# Altium schematic sheet tiny_control.SchDoc
size A4
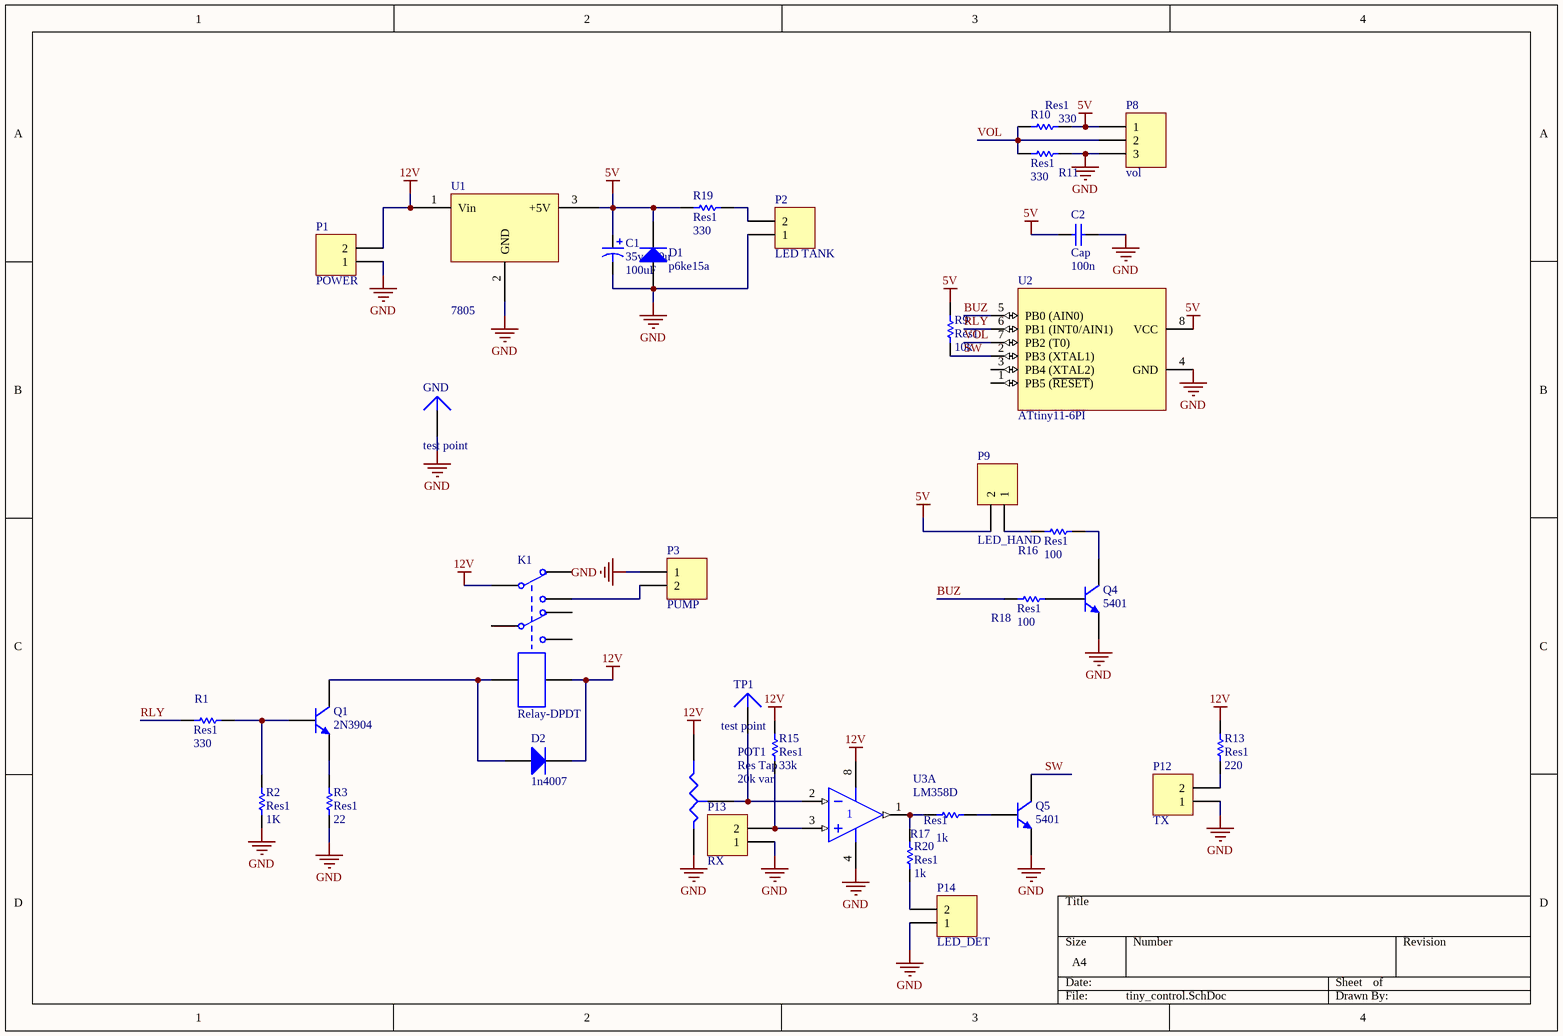
[diagram p0: tiny_control.SchDoc]

## Parts
C1  35v 100u  value 100uF  [cap5]
C2  Cap  value 100n  [RAD-0.1]
D1  p6ke15a  [DIODE-0.4]
D2  1n4007  [DIO7.1-3.9x1.9]
GND  test point  [PIN1]
K1  Relay-DPDT  [My_REL_cochick]
P1  POWER  [con2_2.54]
P2  LED TANK  [con2_2.54]
P3  PUMP  [con2_2.54]
P8  vol  [con3_2.54]
P9  LED_HAND  [con2_2.54]
P12  TX  [con2_2.54]
P13  RX  [con2_2.54]
P14  LED_DET  [con2_2.54]
POT1  Res Tap  value 20k var  [VR5]
Q1  2N3904  [TO-92C]
Q4  5401  [TO-92C]
Q5  5401  [TO-92C]
R1  Res1  value 330  [AXIAL-0.3]
R2  Res1  value 1K  [AXIAL-0.3]
R3  Res1  value 22  [AXIAL-0.3]
R9  Res1  value 10k  [AXIAL-0.3]
R10  Res1  value 330  [AXIAL-0.3]
R11  Res1  value 330  [AXIAL-0.3]
R13  Res1  value 220  [AXIAL-0.3]
R15  Res1  value 33k  [AXIAL-0.3]
R16  Res1  value 100  [AXIAL-0.3]
R17  Res1  value 1k  [AXIAL-0.3]
R18  Res1  value 100  [AXIAL-0.3]
R19  Res1  value 330  [AXIAL-0.3]
R20  Res1  value 1k  [AXIAL-0.3]
TP1  test point  [PIN1]
U1  7805  [TO-220]
U2  ATtiny11-6PI  [SOIC-8]
U3  LM358D  [SOIC-8]  (part A of 2)

## Nets
5V: C1.1 C2.1 D1.2(K) P8.1 P9.2 R9.1 R10.1 R19.2 U1.3(+5V) U2.8(VCC)
12V: D2.2(K) K1.1 K1.8 P1.2 POT1.3 R13.2 R15.2 U1.1(Vin) U3.8(V+)
GND: C1.2 C2.2 D1.1(A) GND.1 P1.1 P2.1 P3.1 P8.3 P12.1 P13.1 P14.1 POT1.1 Q4.3(E) Q5.3(E) R2.1 R3.1 R11.1 U1.2(GND) U2.4(GND) U3.4(V-)
BUZ: R18.1 U2.5(PB0_(AIN0))
RLY: R1.1 U2.6(PB1_(INT0/AIN1))
SW: Q5.1(C) R9.2 U2.2(PB3_(XTAL1))
VOL: P8.2 R10.2 R11.2 U2.7(PB2_(T0))
NetD2_1: D2.1(A) K1.7 Q1.3(C)
NetK1_3: K1.3 P3.2
NetP2_2: P2.2 R19.1
NetP9_1: P9.1 R16.1
NetP12_2: P12.2 R13.1
NetP13_2: P13.2 R15.1 U3.3(IN+)
NetP14_2: P14.2 R20.1
NetPOT1_2: POT1.2 TP1.1 U3.2(IN-)
NetQ1_1: Q1.1(E) R3.2
NetQ1_2: Q1.2(B) R1.2 R2.2
NetQ4_1: Q4.1(C) R16.2
NetQ4_2: Q4.2(B) R18.2
NetQ5_2: Q5.2(B) R17.2
NetR17_1: R17.1 R20.2 U3.1(OUT)

Not connected (* = marked no-connect by the designer): K1 2 4 5 6; U2 1(PB5_(~{RESET})) 3(PB4_(XTAL2))

## Library data of the parts
C1 = Cap Pol1: ELECTROLITE 25V; PackageReference: RB7.6-15; PackageDescription: Polarized Capacitor (Radial); 2 Leads
C2 = Cap: Capacitor; Published: 8-Jun-2000; LatestRevisionDate: 17-Jul-2002; LatestRevisionNote: Re-released for DXP Platform.; PackageReference: RAD-0.3; Publisher: Altium Limited
D1 D2 = Diode 1N4148: High Conductance Fast Diode; DatasheetVersion: 1997; PackageReference: DO-35; PackageDescription: Diode, Axial; Body 3.8 x 1.9 mm (LxDia. max), Lead Dia. 0.53 mm (max); Code_JEDEC: DO-204-AH; ComponentLink1Description: Manufacturer Link; ComponentLink1URL: http://www.fairchildsemi.com/; ComponentLink2Description: Datasheet; ComponentLink2URL: http://www.fairchildsemi.com/ds/1N%2F1N4148.pdf
GND TP1 = Plug: LatestRevisionDate: 17-Jul-2002; LatestRevisionNote: Re-released for DXP Platform.; Publisher: Altium Limited
K1 = Relay-DPDT: Dual-Pole Dual-Throw Relay; Published: 24-Mar-1999; LatestRevisionDate: 17-Jul-2002; LatestRevisionNote: Re-released for DXP Platform.; PackageReference: DIP-P8; Publisher: Altium Limited
P1-P3 P9 P12-P14 = Header 2: Header, 2-Pin; LatestRevisionDate: 17-Jul-2002; LatestRevisionNote: Re-released for DXP Platform.; Publisher: Altium Limited
P8 = Header 3: Header, 3-Pin; LatestRevisionDate: 17-Jul-2002; LatestRevisionNote: Re-released for DXP Platform.; Publisher: Altium Limited
POT1 = Res Tap: Tapped Resistor; Sim Note: Enter the Resistance value and the set point into parameter fields.; Set Position: 0.5; PackageReference: VR3; PackageDescription: Variable Resistor, Thru-Hole; 3 Leads
Q1 = 2N3904: NPN General Purpose Amplifier; Published: 8-Jun-2000; LatestRevisionDate: 15-Jan-2003; LatestRevisionNote: PCB Footprint 'BCY-W3/D4.7' replaced; DatasheetVersion: 1997; PackageVersion: Sep-1998; PackageReference: TO-92A; Publisher: Altium Limited; Code_JEDEC: TO-92A; ComponentLink1Description: Manufacturer Link; ComponentLink1URL: http://www.fairchildsemi.com/; ComponentLink2Description: Datasheet; ComponentLink2URL: http://www.fairchildsemi.com/ds/2N%2F2N3904.pdf
Q4 Q5 = P2N2222A: Transistor; Published: 29-Sep-2000; LatestRevisionDate: 17-Jul-2002; LatestRevisionNote: Re-released for DXP Platform.; DatasheetVersion: 1996; PackageVersion: 1996; PackageReference: 29-04; Publisher: Altium Limited; PackageDescription: TO, Flat Index; 3 In-Line, Axial Leads; Body Dia. 4.8mm; Leads 0.48 x 0.5 mm (max); ComponentLink1Description: Manufacturer Link; ComponentLink1URL: http://www.onsemi.com/site/products/landing?taxonomyID=194; ComponentLink2Description: Datasheet; ComponentLink2URL: http://www.onsemi.com/pub/Collateral/P2N2222A-D.PDF
R1-R3 R9-R11 R13 R15-R20 = Res1: Resistor; Published: 8-Jun-2000; LatestRevisionDate: 17-Jul-2002; LatestRevisionNote: Re-released for DXP Platform.; PackageReference: AXIAL-0.3; Publisher: Altium Limited
U1 = 7805: Regulator
U2 = ATtiny11-6PI: AVR 1K Byte of Flash Memory; Published: 17-Sep-2003; LatestRevisionDate: 04-Mar-2005; LatestRevisionNote: Stylized 3D Model Added.; DatasheetVersion: 1006C-09/01; PackageVersion: revB, Sep-2001; PackageReference: 8P3; Publisher: Altium Limited; PackageDescription: DIP; 8 Leads; Row Spacing 7.62 mm; Pitch 2.54 mm; ComponentLink1Description: Manufacturer Link; ComponentLink1URL: http://www.atmel.com; ComponentLink2Description: Datasheet; ComponentLink2URL: http://www.atmel.com/dyn/resources/prod_documents/doc1006.pdf
U3 = LM358D: Dual Low-Power Operational Amplifier; DatasheetVersion: 1988; PackageReference: 751-02; PackageDescription: 8-Pin Small Outline Integrated Circuit 1.27 mm Pitch; Code_JEDEC: MS-012-AA; Code_IPC: SOIC127P600-8; ComponentLink1Description: Manufacturer Link; ComponentLink1URL: http://www.onsemi.com/site/products/parametrics/0,4446,251,00.html; ComponentLink2Description: Datasheet; ComponentLink2URL: http://www.onsemi.com/pub/Collateral/LM358-D.PDF